# EAGLE design main (EAGLE 9.7.0)
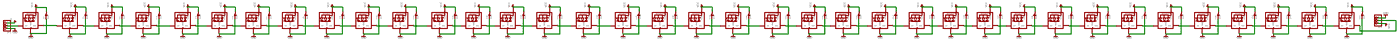
[diagram p0: schematic, sheet 1, overview]
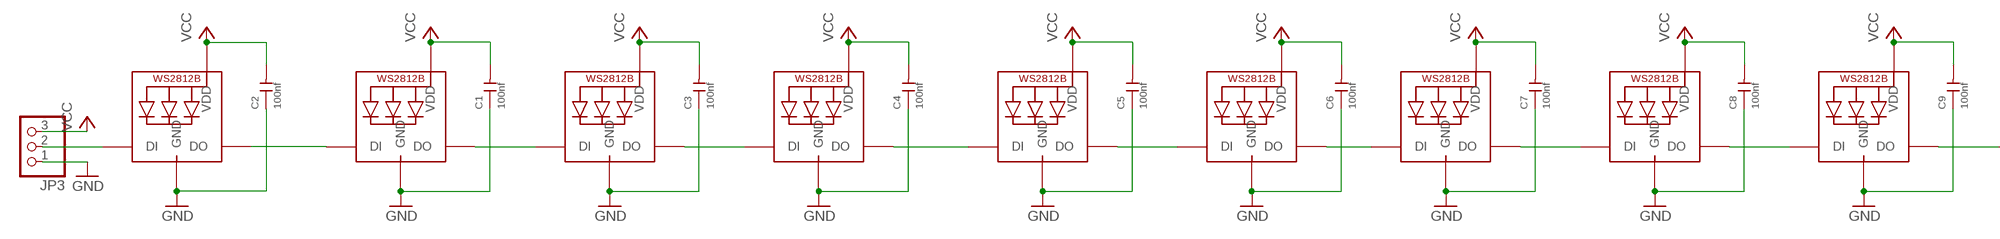
[diagram p1: schematic, sheet 1, part 1 of 4]
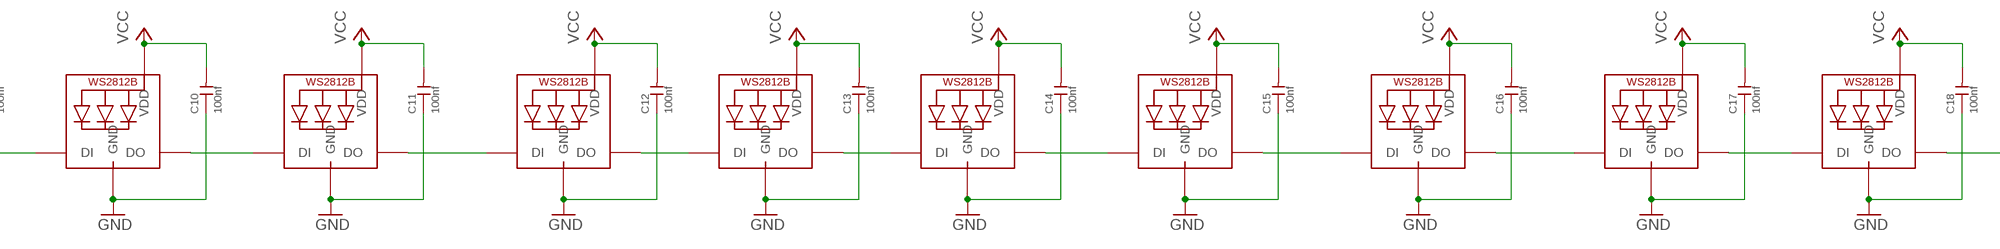
[diagram p2: schematic, sheet 1, part 2 of 4]
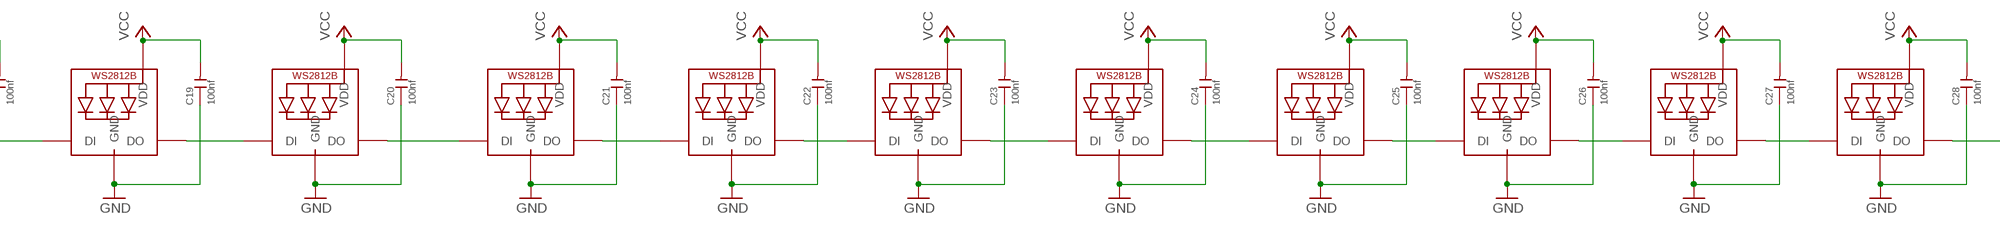
[diagram p3: schematic, sheet 1, part 3 of 4]
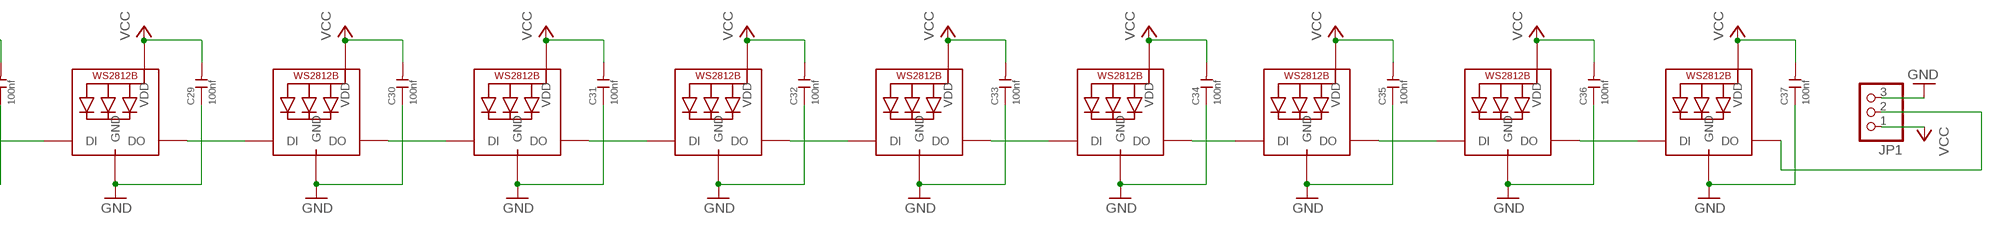
[diagram p4: schematic, sheet 1, part 4 of 4]

## Parts
C1  100nf  CERAMIC-100NF-50V-10%-X7R(0805)  [C0805]
C2  100nf  CERAMIC-100NF-50V-10%-X7R(0805)  [C0805]
C3  100nf  CERAMIC-100NF-50V-10%-X7R(0805)  [C0805]
C4  100nf  CERAMIC-100NF-50V-10%-X7R(0805)  [C0805]
C5  100nf  CERAMIC-100NF-50V-10%-X7R(0805)  [C0805]
C6  100nf  CERAMIC-100NF-50V-10%-X7R(0805)  [C0805]
C7  100nf  CERAMIC-100NF-50V-10%-X7R(0805)  [C0805]
C8  100nf  CERAMIC-100NF-50V-10%-X7R(0805)  [C0805]
C9  100nf  CERAMIC-100NF-50V-10%-X7R(0805)  [C0805]
C10  100nf  CERAMIC-100NF-50V-10%-X7R(0805)  [C0805]
C11  100nf  CERAMIC-100NF-50V-10%-X7R(0805)  [C0805]
C12  100nf  CERAMIC-100NF-50V-10%-X7R(0805)  [C0805]
C13  100nf  CERAMIC-100NF-50V-10%-X7R(0805)  [C0805]
C14  100nf  CERAMIC-100NF-50V-10%-X7R(0805)  [C0805]
C15  100nf  CERAMIC-100NF-50V-10%-X7R(0805)  [C0805]
C16  100nf  CERAMIC-100NF-50V-10%-X7R(0805)  [C0805]
C17  100nf  CERAMIC-100NF-50V-10%-X7R(0805)  [C0805]
C18  100nf  CERAMIC-100NF-50V-10%-X7R(0805)  [C0805]
C19  100nf  CERAMIC-100NF-50V-10%-X7R(0805)  [C0805]
C20  100nf  CERAMIC-100NF-50V-10%-X7R(0805)  [C0805]
C21  100nf  CERAMIC-100NF-50V-10%-X7R(0805)  [C0805]
C22  100nf  CERAMIC-100NF-50V-10%-X7R(0805)  [C0805]
C23  100nf  CERAMIC-100NF-50V-10%-X7R(0805)  [C0805]
C24  100nf  CERAMIC-100NF-50V-10%-X7R(0805)  [C0805]
C25  100nf  CERAMIC-100NF-50V-10%-X7R(0805)  [C0805]
C26  100nf  CERAMIC-100NF-50V-10%-X7R(0805)  [C0805]
C27  100nf  CERAMIC-100NF-50V-10%-X7R(0805)  [C0805]
C28  100nf  CERAMIC-100NF-50V-10%-X7R(0805)  [C0805]
C29  100nf  CERAMIC-100NF-50V-10%-X7R(0805)  [C0805]
C30  100nf  CERAMIC-100NF-50V-10%-X7R(0805)  [C0805]
C31  100nf  CERAMIC-100NF-50V-10%-X7R(0805)  [C0805]
C32  100nf  CERAMIC-100NF-50V-10%-X7R(0805)  [C0805]
C33  100nf  CERAMIC-100NF-50V-10%-X7R(0805)  [C0805]
C34  100nf  CERAMIC-100NF-50V-10%-X7R(0805)  [C0805]
C35  100nf  CERAMIC-100NF-50V-10%-X7R(0805)  [C0805]
C36  100nf  CERAMIC-100NF-50V-10%-X7R(0805)  [C0805]
C37  100nf  CERAMIC-100NF-50V-10%-X7R(0805)  [C0805]
JP1  PINHD-1X3  [1X03]
JP3  PINHD-1X3  [1X03]
L  WS2812B5050  [WS2812B]
LED1  WS2812B5050  [WS2812B]
LED3  WS2812B5050  [WS2812B]
LED4  WS2812B5050  [WS2812B]
LED5  WS2812B5050  [WS2812B]
LED6  WS2812B5050  [WS2812B]
LED7  WS2812B5050  [WS2812B]
LED8  WS2812B5050  [WS2812B]
LED9  WS2812B5050  [WS2812B]
LED10  WS2812B5050  [WS2812B]
LED11  WS2812B5050  [WS2812B]
LED12  WS2812B5050  [WS2812B]
LED13  WS2812B5050  [WS2812B]
LED14  WS2812B5050  [WS2812B]
LED15  WS2812B5050  [WS2812B]
LED16  WS2812B5050  [WS2812B]
LED17  WS2812B5050  [WS2812B]
LED18  WS2812B5050  [WS2812B]
LED19  WS2812B5050  [WS2812B]
LED20  WS2812B5050  [WS2812B]
LED21  WS2812B5050  [WS2812B]
LED22  WS2812B5050  [WS2812B]
LED23  WS2812B5050  [WS2812B]
LED24  WS2812B5050  [WS2812B]
LED25  WS2812B5050  [WS2812B]
LED26  WS2812B5050  [WS2812B]
LED27  WS2812B5050  [WS2812B]
LED28  WS2812B5050  [WS2812B]
LED29  WS2812B5050  [WS2812B]
LED30  WS2812B5050  [WS2812B]
LED31  WS2812B5050  [WS2812B]
LED32  WS2812B5050  [WS2812B]
LED33  WS2812B5050  [WS2812B]
LED34  WS2812B5050  [WS2812B]
LED35  WS2812B5050  [WS2812B]
LED36  WS2812B5050  [WS2812B]
LED37  WS2812B5050  [WS2812B]

## Nets
GND: C1.1 C2.1 C3.1 C4.1 C5.1 C6.1 C7.1 C8.1 C9.1 C10.1 C11.1 C12.1 C13.1 C14.1 C15.1 C16.1 C17.1 C18.1 C19.1 C20.1 C21.1 C22.1 C23.1 C24.1 C25.1 C26.1 C27.1 C28.1 C29.1 C30.1 C31.1 C32.1 C33.1 C34.1 C35.1 C36.1 C37.1 JP1.3 JP3.1 L.3-GND(GND) LED1.3-GND(GND) LED3.3-GND(GND) LED4.3-GND(GND) LED5.3-GND(GND) LED6.3-GND(GND) LED7.3-GND(GND) LED8.3-GND(GND) LED9.3-GND(GND) LED10.3-GND(GND) LED11.3-GND(GND) LED12.3-GND(GND) LED13.3-GND(GND) LED14.3-GND(GND) LED15.3-GND(GND) LED16.3-GND(GND) LED17.3-GND(GND) LED18.3-GND(GND) LED19.3-GND(GND) LED20.3-GND(GND) LED21.3-GND(GND) LED22.3-GND(GND) LED23.3-GND(GND) LED24.3-GND(GND) LED25.3-GND(GND) LED26.3-GND(GND) LED27.3-GND(GND) LED28.3-GND(GND) LED29.3-GND(GND) LED30.3-GND(GND) LED31.3-GND(GND) LED32.3-GND(GND) LED33.3-GND(GND) LED34.3-GND(GND) LED35.3-GND(GND) LED36.3-GND(GND) LED37.3-GND(GND)
N$1: L.2-DOUT(DO) LED1.4-DIN(DI)
N$2: LED1.2-DOUT(DO) LED3.4-DIN(DI)
N$3: LED3.2-DOUT(DO) LED4.4-DIN(DI)
N$4: LED4.2-DOUT(DO) LED5.4-DIN(DI)
N$5: LED5.2-DOUT(DO) LED6.4-DIN(DI)
N$6: LED6.2-DOUT(DO) LED7.4-DIN(DI)
N$7: LED7.2-DOUT(DO) LED8.4-DIN(DI)
N$8: LED8.2-DOUT(DO) LED9.4-DIN(DI)
N$9: LED9.2-DOUT(DO) LED10.4-DIN(DI)
N$10: LED10.2-DOUT(DO) LED11.4-DIN(DI)
N$11: LED11.2-DOUT(DO) LED12.4-DIN(DI)
N$12: LED12.2-DOUT(DO) LED13.4-DIN(DI)
N$13: LED13.2-DOUT(DO) LED14.4-DIN(DI)
N$14: LED14.2-DOUT(DO) LED15.4-DIN(DI)
N$15: LED15.2-DOUT(DO) LED16.4-DIN(DI)
N$16: LED16.2-DOUT(DO) LED17.4-DIN(DI)
N$17: LED17.2-DOUT(DO) LED18.4-DIN(DI)
N$18: LED18.2-DOUT(DO) LED19.4-DIN(DI)
N$19: LED19.2-DOUT(DO) LED20.4-DIN(DI)
N$20: LED20.2-DOUT(DO) LED21.4-DIN(DI)
N$21: LED21.2-DOUT(DO) LED22.4-DIN(DI)
N$22: LED22.2-DOUT(DO) LED23.4-DIN(DI)
N$23: LED23.2-DOUT(DO) LED24.4-DIN(DI)
N$24: LED24.2-DOUT(DO) LED25.4-DIN(DI)
N$25: LED25.2-DOUT(DO) LED26.4-DIN(DI)
N$26: LED26.2-DOUT(DO) LED27.4-DIN(DI)
N$27: LED27.2-DOUT(DO) LED28.4-DIN(DI)
N$28: LED28.2-DOUT(DO) LED29.4-DIN(DI)
N$29: LED29.2-DOUT(DO) LED30.4-DIN(DI)
N$30: LED30.2-DOUT(DO) LED31.4-DIN(DI)
N$31: LED31.2-DOUT(DO) LED32.4-DIN(DI)
N$32: LED32.2-DOUT(DO) LED33.4-DIN(DI)
N$33: LED33.2-DOUT(DO) LED34.4-DIN(DI)
N$34: LED34.2-DOUT(DO) LED35.4-DIN(DI)
N$35: LED35.2-DOUT(DO) LED36.4-DIN(DI)
N$36: LED36.2-DOUT(DO) LED37.4-DIN(DI)
N$37: JP3.2 L.4-DIN(DI)
N$38: JP1.2 LED37.2-DOUT(DO)
VCC: C1.2 C2.2 C3.2 C4.2 C5.2 C6.2 C7.2 C8.2 C9.2 C10.2 C11.2 C12.2 C13.2 C14.2 C15.2 C16.2 C17.2 C18.2 C19.2 C20.2 C21.2 C22.2 C23.2 C24.2 C25.2 C26.2 C27.2 C28.2 C29.2 C30.2 C31.2 C32.2 C33.2 C34.2 C35.2 C36.2 C37.2 JP1.1 JP3.3 L.1-VDD(VDD) LED1.1-VDD(VDD) LED3.1-VDD(VDD) LED4.1-VDD(VDD) LED5.1-VDD(VDD) LED6.1-VDD(VDD) LED7.1-VDD(VDD) LED8.1-VDD(VDD) LED9.1-VDD(VDD) LED10.1-VDD(VDD) LED11.1-VDD(VDD) LED12.1-VDD(VDD) LED13.1-VDD(VDD) LED14.1-VDD(VDD) LED15.1-VDD(VDD) LED16.1-VDD(VDD) LED17.1-VDD(VDD) LED18.1-VDD(VDD) LED19.1-VDD(VDD) LED20.1-VDD(VDD) LED21.1-VDD(VDD) LED22.1-VDD(VDD) LED23.1-VDD(VDD) LED24.1-VDD(VDD) LED25.1-VDD(VDD) LED26.1-VDD(VDD) LED27.1-VDD(VDD) LED28.1-VDD(VDD) LED29.1-VDD(VDD) LED30.1-VDD(VDD) LED31.1-VDD(VDD) LED32.1-VDD(VDD) LED33.1-VDD(VDD) LED34.1-VDD(VDD) LED35.1-VDD(VDD) LED36.1-VDD(VDD) LED37.1-VDD(VDD)

## Library data of the parts
C1-C37 = OPL_Capacitor:CERAMIC-100NF-50V-10%-X7R(0805): 302010165; MPN: CC0805KRX7R9BB104
JP1 JP3 = adafruit:PINHD-1X3: PIN HEADER
L LED1 LED3-LED37 = adafruit:WS2812B

## Board
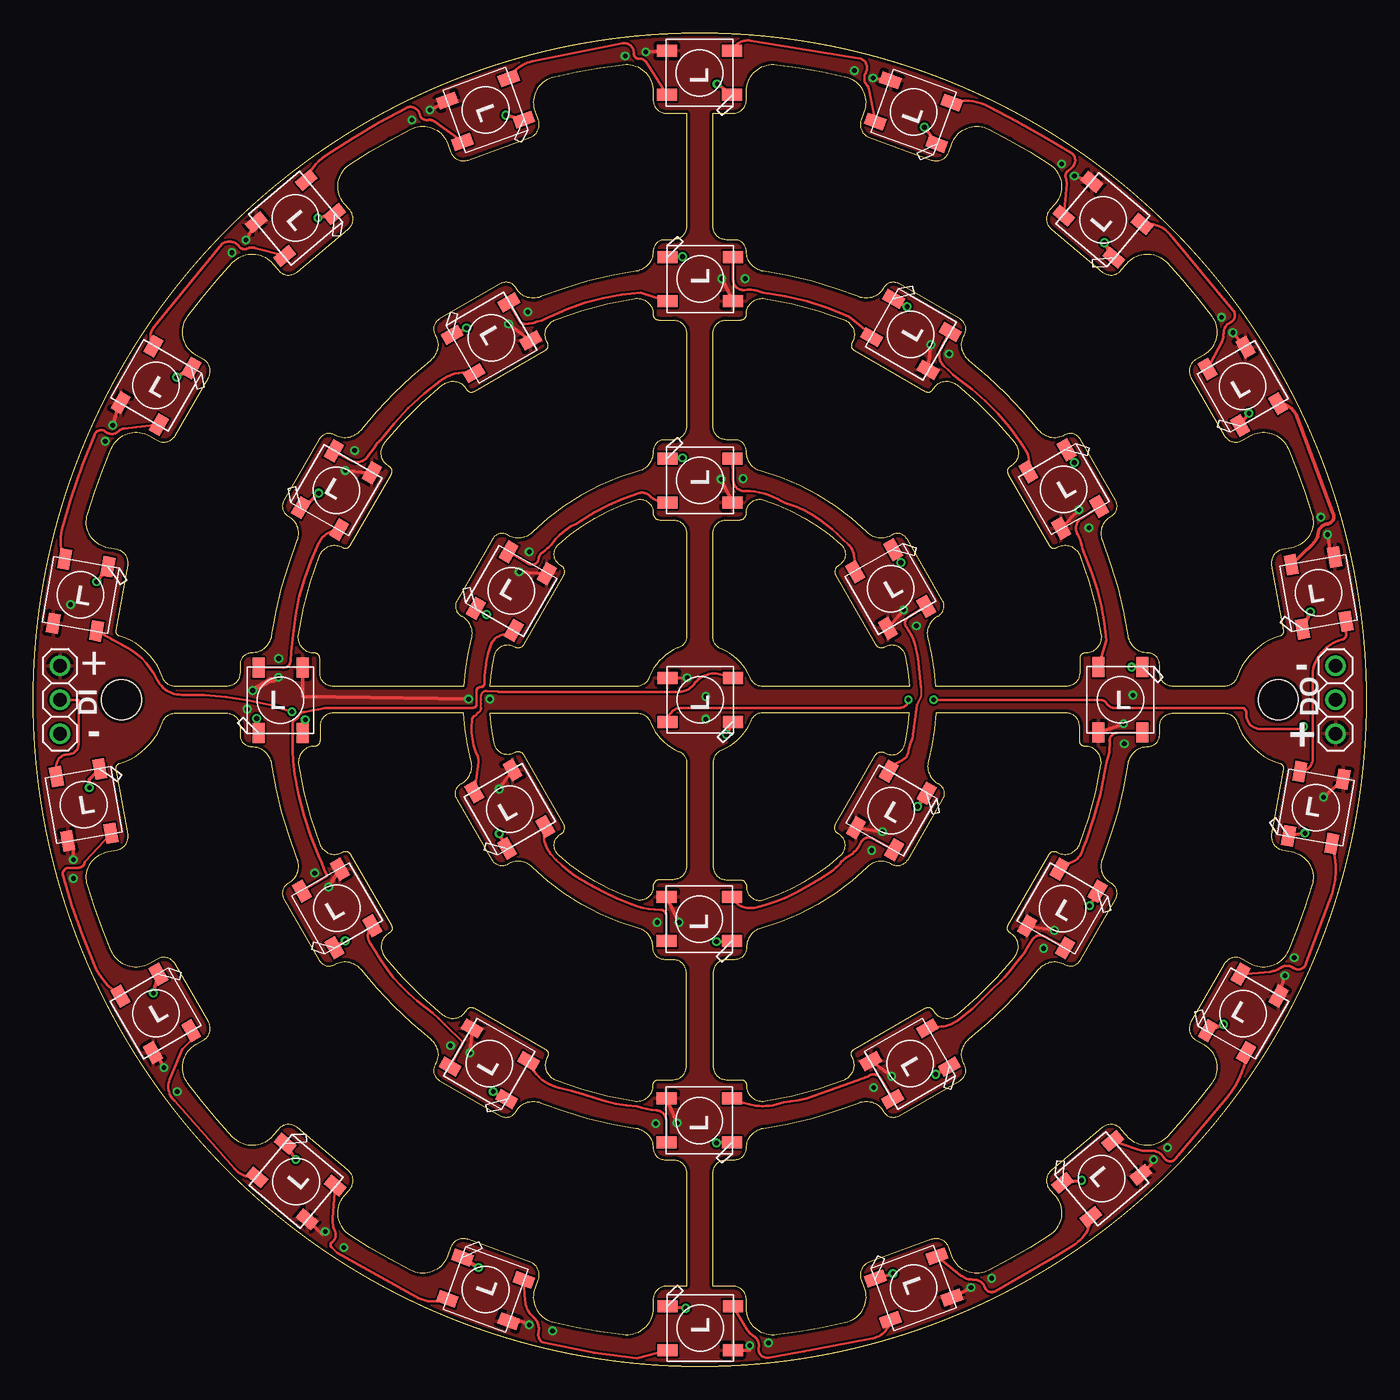
[diagram p5: board, top side]
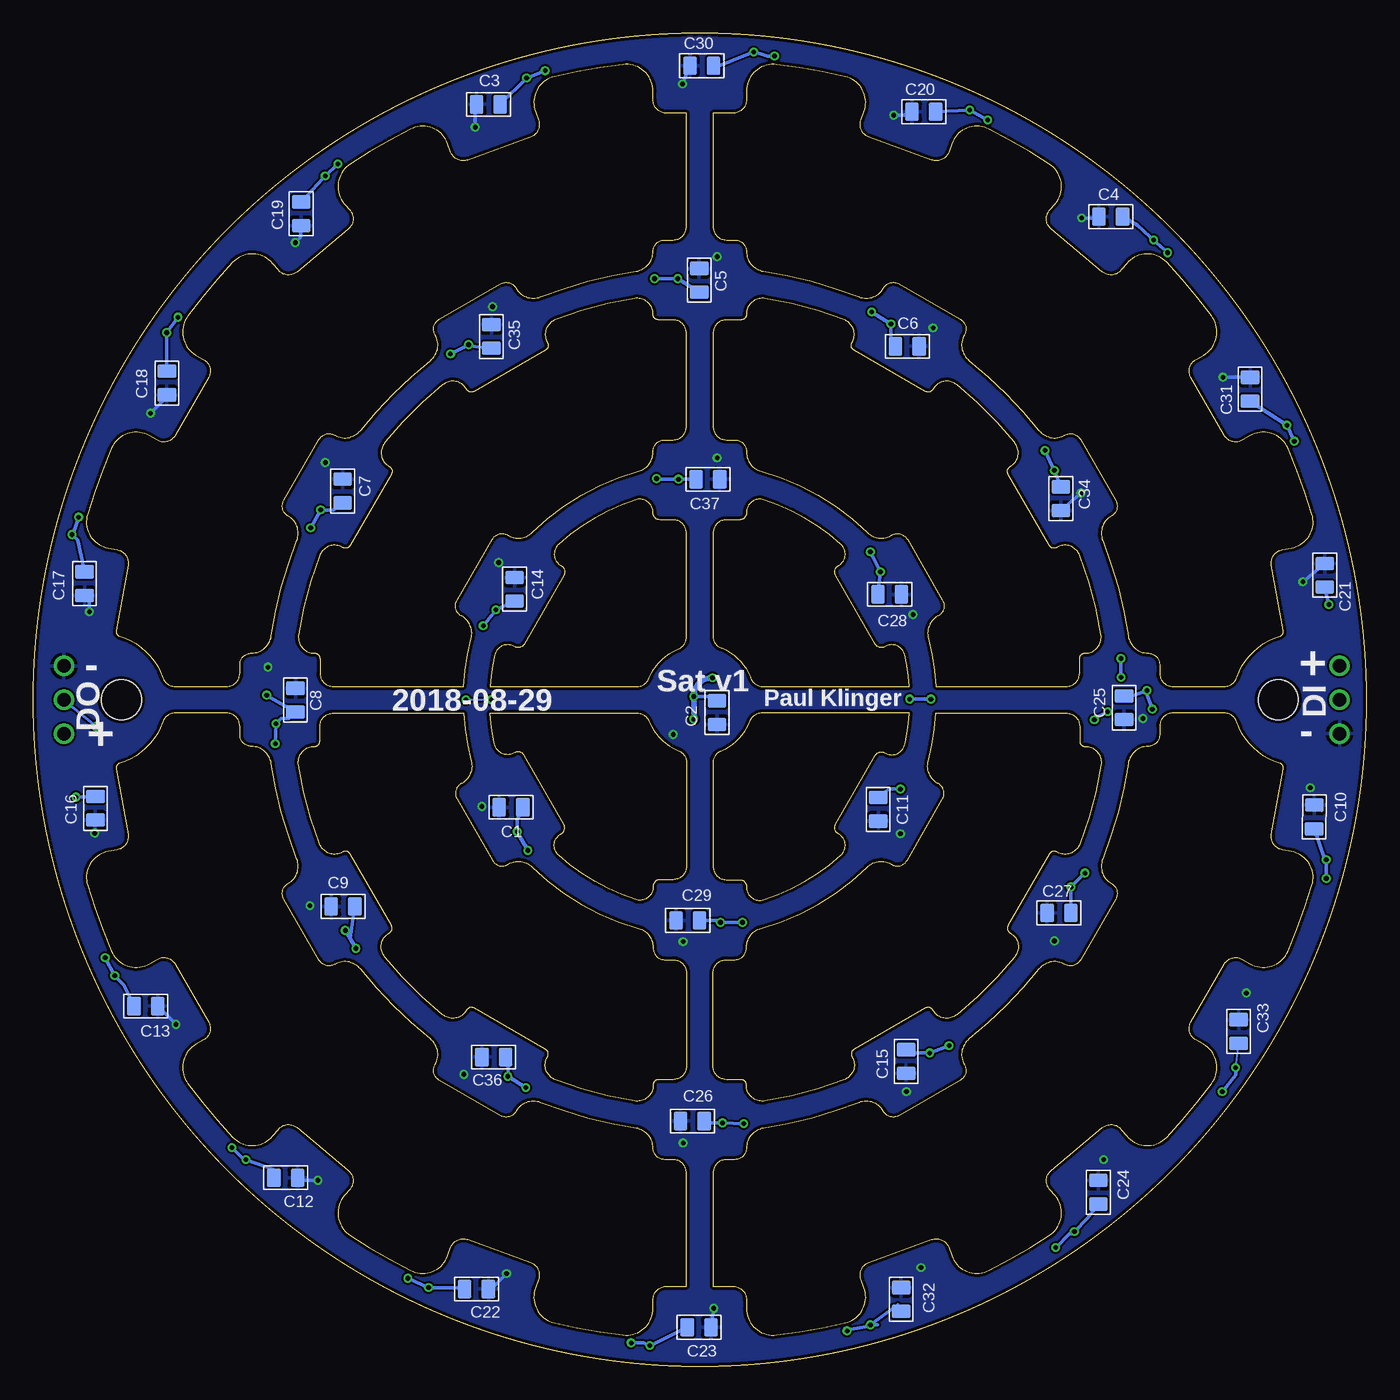
[diagram p6: board, bottom side, seen from below]

Size 100 x 100 mm. Coordinates in mm from the lower left corner, seen from the top.
Outline: 53.5,95 53.5,95.67 arc-97 55.74,97.66 arc-6 60.91,96.75 arc-97 62.33,94.11 62.1,93.48 arc90 62.7,92.2 67.4,90.49 arc90 68.68,91.09 68.91,91.72 arc-97 71.69,92.82 arc-6 76.24,90.19 arc-97 76.67,87.23 76.24,86.72 arc90 76.37,85.31 80.2,82.1 arc90 81.61,82.22 82.04,82.74 arc-97 85.03,82.82 arc-6 88.4,78.8 arc-97 87.8,75.87 87.22,75.53 arc90 86.85,74.16 89.35,69.84 arc90 90.72,69.47 91.3,69.8 arc-97 94.14,68.86 arc-6 95.94,63.93 arc-97 94.37,61.38 93.71,61.26 arc90 92.9,60.1 93.77,55.18 arc2 93.77,55.14 arc-86 93.57,54.79 arc54 90.29,51.67 arc-71 89.34,51 85.5,51 arc-90 84.5,52 84.5,52.65 arc90 83.65,53.5 83.63,53.5 arc-82 82.15,54.78 arc13 80.23,61.93 arc-82 80.88,63.78 80.89,63.79 arc90 81.2,64.95 78.55,69.55 arc90 77.39,69.86 77.38,69.85 arc-82 75.45,70.21 arc13 70.21,75.45 arc-82 69.85,77.38 69.86,77.39 arc90 69.55,78.55 64.95,81.2 arc90 63.79,80.89 63.78,80.88 arc-82 61.93,80.23 arc13 54.78,82.15 arc-82 53.5,83.63 53.5,83.65 arc90 52.65,84.5 52,84.5 arc-90 51,85.5 51,94 52.5,94 arc90 53.5,95
Outline: 46.5,95.67 46.5,95 arc90 47.5,94 49,94 49,85.5 arc-90 48,84.5 47.35,84.5 arc90 46.5,83.65 46.5,83.63 arc-82 45.22,82.15 arc13 38.07,80.23 arc-82 36.22,80.88 36.21,80.89 arc90 35.05,81.2 30.45,78.55 arc90 30.14,77.39 30.15,77.38 arc-82 29.79,75.45 arc13 24.55,70.21 arc-82 22.62,69.85 22.61,69.86 arc90 21.45,69.55 18.8,64.95 arc90 19.11,63.79 19.12,63.78 arc-82 19.77,61.93 arc13 17.85,54.78 arc-82 16.37,53.5 16.35,53.5 arc90 15.5,52.65 15.5,52 arc-90 14.5,51 10.66,51 arc-71 9.71,51.67 arc54 6.43,54.79 arc-86 6.23,55.14 arc2 6.23,55.18 7.1,60.1 arc90 6.29,61.26 5.63,61.38 arc-97 4.06,63.93 arc-6 5.86,68.86 arc-97 8.7,69.8 9.28,69.47 arc90 10.65,69.84 13.15,74.16 arc90 12.78,75.53 12.2,75.87 arc-97 11.6,78.8 arc-6 14.97,82.82 arc-97 17.96,82.74 18.39,82.22 arc90 19.8,82.1 23.63,85.31 arc90 23.76,86.72 23.32,87.23 arc-97 23.76,90.19 arc-6 28.31,92.82 arc-97 31.09,91.72 31.32,91.09 arc90 32.6,90.49 37.3,92.2 arc90 37.9,93.48 37.67,94.11 arc-97 39.09,96.75 arc-6 44.26,97.66 arc-97 46.5,95.67
Outline: 4.06,36.07 arc-97 5.63,38.62 6.29,38.74 arc90 7.1,39.9 6.23,44.82 arc2 6.23,44.86 arc-86 6.43,45.21 arc54 9.71,48.33 arc-71 10.66,49 14.5,49 arc-90 15.5,48 15.5,47.35 arc90 16.35,46.5 16.37,46.5 arc-82 17.85,45.22 arc13 19.77,38.07 arc-82 19.12,36.22 19.11,36.21 arc90 18.8,35.05 21.45,30.45 arc90 22.61,30.14 22.62,30.15 arc-82 24.55,29.79 arc13 29.79,24.55 arc-82 30.15,22.62 30.14,22.61 arc90 30.45,21.45 35.05,18.8 arc90 36.21,19.11 36.22,19.12 arc-82 38.07,19.77 arc13 45.22,17.85 arc-82 46.5,16.37 46.5,16.35 arc90 47.35,15.5 48,15.5 arc-90 49,14.5 49,6 47.5,6 arc90 46.5,5 46.5,4.33 arc-97 44.26,2.34 arc-6 39.09,3.26 arc-97 37.67,5.89 37.9,6.52 arc90 37.3,7.8 32.6,9.51 arc90 31.32,8.91 31.09,8.28 arc-97 28.31,7.18 arc-6 23.76,9.8 arc-97 23.32,12.77 23.76,13.28 arc90 23.63,14.69 19.8,17.9 arc90 18.39,17.78 17.96,17.26 arc-97 14.97,17.18 arc-6 11.6,21.2 arc-97 12.2,24.13 12.78,24.47 arc90 13.15,25.84 10.65,30.16 arc90 9.28,30.53 8.7,30.2 arc-97 5.86,31.14 arc-6 4.06,36.07
Outline: 55.74,2.34 arc-97 53.5,4.33 53.5,5 arc90 52.5,6 51,6 51,14.5 arc-90 52,15.5 52.65,15.5 arc90 53.5,16.35 53.5,16.37 arc-82 54.78,17.85 arc13 61.93,19.77 arc-82 63.78,19.12 63.79,19.11 arc90 64.95,18.8 69.55,21.45 arc90 69.86,22.61 69.85,22.62 arc-82 70.21,24.55 arc13 75.45,29.79 arc-82 77.38,30.15 77.39,30.14 arc90 78.55,30.45 81.2,35.05 arc90 80.89,36.21 80.88,36.22 arc-82 80.23,38.07 arc13 82.15,45.22 arc-82 83.63,46.5 83.65,46.5 arc90 84.5,47.35 84.5,48 arc-90 85.5,49 89.34,49 arc-71 90.29,48.33 arc54 93.57,45.21 arc-86 93.77,44.86 arc2 93.77,44.82 92.9,39.9 arc90 93.71,38.74 94.37,38.62 arc-97 95.94,36.07 arc-6 94.14,31.14 arc-97 91.3,30.2 90.72,30.53 arc90 89.35,30.16 86.85,25.84 arc90 87.22,24.47 87.8,24.13 arc-97 88.4,21.2 arc-6 85.03,17.18 arc-97 82.04,17.26 81.61,17.78 arc90 80.2,17.9 76.37,14.69 arc90 76.24,13.28 76.67,12.77 arc-97 76.24,9.8 arc-6 71.69,7.18 arc-97 68.91,8.28 68.68,8.91 arc90 67.4,9.51 62.7,7.8 arc90 62.1,6.52 62.33,5.89 arc-97 60.91,3.26 arc-6 55.74,2.34
Outline: 46.5,78.92 46.5,78.9 arc90 46.9,78.5 48,78.5 arc-90 49,77.5 49,70.5 arc-90 48,69.5 47.35,69.5 arc90 46.5,68.65 46.5,68.59 arc-75 45.39,67.14 arc30 37.46,62.56 arc-75 35.65,62.33 35.6,62.36 arc90 34.44,62.05 31.79,57.45 arc90 32.1,56.29 32.15,56.26 arc-75 32.85,54.58 arc12 32.28,51 22.5,51 arc-90 21.5,52 21.5,53.1 arc90 21.1,53.5 21.08,53.5 arc-99 19.89,54.89 arc-12 21.48,60.82 arc-99 23.2,61.43 23.22,61.42 arc90 23.77,61.56 26.87,66.94 arc90 26.72,67.48 26.7,67.49 arc-99 26.38,69.29 arc-12 30.71,73.62 arc-99 32.51,73.3 32.52,73.28 arc90 33.06,73.13 38.44,76.23 arc90 38.58,76.78 38.57,76.8 arc-99 39.18,78.52 arc-12 45.11,80.11 arc-99 46.5,78.92
Outline: 53.5,78.9 53.5,78.92 arc-99 54.89,80.11 arc-12 60.82,78.52 arc-99 61.43,76.8 61.42,76.78 arc90 61.56,76.23 66.94,73.13 arc90 67.48,73.28 67.49,73.3 arc-99 69.29,73.62 arc-12 73.62,69.29 arc-99 73.3,67.49 73.28,67.48 arc90 73.13,66.94 76.23,61.56 arc90 76.78,61.42 76.8,61.43 arc-99 78.52,60.82 arc-12 80.11,54.89 arc-99 78.92,53.5 78.9,53.5 arc90 78.5,53.1 78.5,52 arc-90 77.5,51 67.72,51 arc12 67.15,54.58 arc-75 67.85,56.26 67.9,56.29 arc90 68.21,57.45 65.56,62.05 arc90 64.4,62.36 64.35,62.33 arc-75 62.54,62.56 arc30 54.61,67.14 arc-75 53.5,68.59 53.5,68.65 arc90 52.65,69.5 52,69.5 arc-90 51,70.5 51,77.5 arc-90 52,78.5 53.1,78.5 arc90 53.5,78.9
Outline: 21.5,46.9 arc-90 21.1,46.5 21.08,46.5 arc99 19.89,45.11 arc12 21.48,39.18 arc99 23.2,38.57 23.22,38.58 arc-90 23.77,38.44 26.87,33.06 arc-90 26.72,32.52 26.7,32.51 arc99 26.38,30.71 arc12 30.71,26.38 arc99 32.51,26.7 32.52,26.72 arc-90 33.06,26.87 38.44,23.77 arc-90 38.58,23.22 38.57,23.2 arc99 39.18,21.48 arc12 45.11,19.89 arc99 46.5,21.08 46.5,21.1 arc-90 46.9,21.5 48,21.5 arc90 49,22.5 49,29.5 arc90 48,30.5 47.35,30.5 arc-90 46.5,31.35 46.5,31.41 arc75 45.39,32.86 arc-30 37.46,37.44 arc75 35.65,37.67 35.6,37.64 arc-90 34.44,37.95 31.79,42.55 arc-90 32.1,43.71 32.15,43.74 arc75 32.85,45.42 arc-12 32.28,49 22.5,49 arc90 21.5,48 21.5,46.9
Outline: 53.1,21.5 arc-90 53.5,21.1 53.5,21.08 arc99 54.89,19.89 arc12 60.82,21.48 arc99 61.43,23.2 61.42,23.22 arc-90 61.56,23.77 66.94,26.87 arc-90 67.48,26.72 67.49,26.7 arc99 69.29,26.38 arc12 73.62,30.71 arc99 73.3,32.51 73.28,32.52 arc-90 73.13,33.06 76.23,38.44 arc-90 76.78,38.58 76.8,38.57 arc99 78.52,39.18 arc12 80.11,45.11 arc99 78.92,46.5 78.9,46.5 arc-90 78.5,46.9 78.5,48 arc90 77.5,49 67.72,49 arc-12 67.15,45.42 arc75 67.85,43.74 67.9,43.71 arc-90 68.21,42.55 65.56,37.95 arc-90 64.4,37.64 64.35,37.67 arc75 62.54,37.44 arc-30 54.61,32.86 arc75 53.5,31.41 53.5,31.35 arc-90 52.65,30.5 52,30.5 arc90 51,29.5 51,22.5 arc90 52,21.5 53.1,21.5
Outline: 46.5,64.05 46.5,64 arc90 47,63.5 48,63.5 arc-90 49,62.5 49,54.58 arc-66 48.3,53.87 arc43 46.23,51.8 arc-66 45.42,51 34.28,51 arc-9 34.61,53.34 arc-108 36.09,53.99 36.13,53.97 arc90 36.81,54.15 39.81,59.35 arc90 39.63,60.03 39.59,60.05 arc-108 39.41,61.66 arc-24 45.2,65 arc-108 46.5,64.05
Outline: 53.5,64 53.5,64.05 arc-108 54.8,65 arc-24 60.59,61.66 arc-108 60.41,60.05 60.37,60.03 arc90 60.19,59.35 63.19,54.15 arc90 63.87,53.97 63.91,53.99 arc-108 65.39,53.34 arc-9 65.72,51 54.58,51 arc-66 53.77,51.7 arc43 51.7,53.77 arc-66 51,54.58 51,62.5 arc-90 52,63.5 53,63.5 arc90 53.5,64
Outline: 39.81,40.65 36.81,45.85 arc90 36.13,46.03 36.09,46.01 arc-108 34.61,46.66 arc-9 34.28,49 45.42,49 arc-66 46.33,48.2 arc43 48.4,46.13 arc-66 49,45.42 49,37.5 arc-90 48,36.5 47,36.5 arc90 46.5,36 46.5,35.95 arc-108 45.2,35 arc-24 39.41,38.34 arc-108 39.59,39.95 39.63,39.97 arc90 39.81,40.65
Outline: 53,36.5 arc-90 53.5,36 53.5,35.95 arc108 54.8,35 arc24 60.59,38.34 arc108 60.41,39.95 60.37,39.97 arc-90 60.19,40.65 63.19,45.85 arc-90 63.87,46.03 63.91,46.01 arc108 65.39,46.66 arc9 65.72,49 54.58,49 arc66 53.77,48.3 arc-43 51.7,46.23 arc66 51,45.42 51,37.5 arc90 52,36.5 53,36.5
Outline: circle at 50,50 radius 50
Copper layers (1*16): Top 0.035mm / dielectric 1.5mm / Bottom 0.035mm
Design rules "dirt_cheap_dirty_boards.v1.1": minimum track width 6mil, minimum drill 12mil, track to track 6mil, track to pad 6mil, pad to pad 6mil, via to via 6mil, smd to smd 0mil, copper to edge 10mil, drill to drill 10mil, minimum pad ring 10mil, minimum via ring 6mil, stop-mask expansion 2mil, vias tented up to drill 25mil, thermal gap 10mil
Holes 3 mm at 6.6,50 93.4,50

### Footprints (pad centres in the part's own frame; a part is rotated, then mirrored left to right if it is on the bottom)
C0805 = smd 1.397 x 1.016: 1 0,0.889; 2 0,-0.889
1X03 = drill 1.016: 1 -2.54,0; 2 0,0; 3 2.54,0
WS2812B = smd 1.5 x 0.9: 1-VDD 2.45,-1.65; 2-DOUT 2.45,1.65; 3-GND -2.45,1.65; 4-DIN -2.45,-1.65

### Placement (x,y rotation side)
C1  64.16,41.93 90 bottom
C2  48.7,49.04 180 bottom
C3  65.86,94.67 90 bottom
C4  19.16,86.24 90 bottom
C5  50.04,81.47 0 bottom
C6  34.43,76.52 270 bottom
C7  76.8,65.67 0 bottom
C8  80.33,49.97 0 bottom
C9  76.77,34.49 90 bottom
C10  3.9,41.2 359.5 bottom
C11  36.61,41.78 180 bottom
C12  81.06,14.14 270 bottom
C13  91.56,27.02 270 bottom
C14  63.9,58.29 0 bottom
C15  34.52,22.86 180 bottom
C16  95.34,41.86 180 bottom
C17  96.16,58.71 180 bottom
C18  89.98,73.76 180 bottom
C19  79.9,86.46 180 bottom
C20  33.19,94.12 90 bottom
C21  3.11,59.34 0 bottom
C22  66.75,5.79 270 bottom
C23  50.05,2.92 270 bottom
C24  20.1,13.05 0 bottom
C25  18.17,49.4 180 bottom
C26  50.55,18.39 90 bottom
C27  23.05,34.01 90 bottom
C28  35.75,57.91 270 bottom
C29  50.9,33.45 90 bottom
C30  49.85,97.57 90 bottom
C31  8.71,73.3 0 bottom
C32  34.89,5.01 0 bottom
C33  9.57,25.11 0 bottom
C34  22.9,65.09 180 bottom
C35  65.63,77.26 0 bottom
C36  65.46,23.19 90 bottom
C37  49.39,66.54 270 bottom
JP1  97.7,50 90 top
JP3  2,50 90 top
L  3.78,42.11 280 top
LED1  9.19,26.47 300 top
LED3  19.72,13.86 320 top
LED4  33.93,5.76 340 top
LED5  50.04,2.86 0 top
LED6  66.05,5.86 20 top
LED7  80.16,14.06 40 top
LED8  90.77,26.46 60 top
LED9  96.22,41.91 80 top
LED10  96.43,58.01 100 top
LED11  90.74,73.51 120 top
LED12  80.25,86.01 140 top
LED13  66.04,94.09 160 top
LED14  49.98,97.04 180 top
LED15  33.93,94.24 200 top
LED16  19.67,86.14 220 top
LED17  9.21,73.59 240 top
LED18  3.55,57.86 260 top
LED19  18.54,49.96 90 top
LED20  22.74,65.72 60 top
LED21  34.37,77.16 30 top
LED22  50.03,81.56 0 top
LED23  65.84,77.41 330 top
LED24  77.31,65.8 300 top
LED25  81.56,49.99 270 top
LED26  77.21,34.33 240 top
LED27  65.78,22.69 210 top
LED28  49.97,18.44 180 top
LED29  34.21,22.69 150 top
LED30  22.79,34.35 120 top
LED31  35.86,58.16 60 top
LED32  50.02,66.46 0 top
LED33  64.32,58.31 300 top
LED34  64.37,41.69 240 top
LED35  49.96,33.54 180 top
LED36  35.75,41.79 120 top
LED37  50.04,49.99 180 top

### Tracks (layer width: path | path; a pad name or v marks a point on that pad's centre or on a via)
GND  (via drill 0.35)
  Top 0.152: L.3-GND arc90 5.3,45.13
  Top 0.2: LED31.3-GND v34,56.4
  Top 0.254: 5.3,45.13 arc-90 L.3-GND 4.2,44.03 v4.2,43.4 | LED1.3-GND v9,28 | LED3.3-GND v19.7,15.5 | LED4.3-GND v33.4,7.4 | LED9.3-GND v95.4,40 | LED5.3-GND v48.95,4.35 | LED6.3-GND v64.5,6.95 | LED7.3-GND v78.65,13.95 | LED8.3-GND v89.3,25.65 | LED10.3-GND v95.8,56.6 | LED11.3-GND v91.2,71.5 | LED12.3-GND v80.35,84.3 | LED13.3-GND v66.85,92.95 | LED14.3-GND v51.3,96.2 | LED15.3-GND v35.45,93.85 | LED16.3-GND v21.35,86.15 | LED17.3-GND v10.75,74.2 | LED18.3-GND v4.75,58.85 | LED20.3-GND 20.21,64.31 v21.4,65.5 | v16.75,48.6 LED19.3-GND | LED21.3-GND v32.5,77.9 | LED22.3-GND v48.7,83.25 | LED23.3-GND v65.55,79.5 | LED24.3-GND v78.1,67.8 | LED25.3-GND v82.4,52.45 | LED26.3-GND v79.25,34.55 | LED27.3-GND v67.7,21.9 | LED28.3-GND v51.25,16.75 | LED29.3-GND v34.5,20.6 | LED32.3-GND v48.7,68.15 | LED34.3-GND v66.35,42 | LED35.3-GND v51.25,31.85 | LED36.3-GND v34.95,39.95 | LED37.3-GND v52,47.4 | LED33.3-GND v65.1,60.3 | LED30.3-GND v23.4,31.9
  Bottom 0.254: v48.95,4.35 C23.1 | C22.1 65.41,6.04 v64.5,6.95 | C12.1 80.17,13.95 v78.65,13.95 | C13.1 v89.3,25.65 | C17.1 95.8,57.42 v95.8,56.6 | C18.1 89.81,72.89 v91.2,71.5 | C19.1 79.96,84.69 v80.35,84.3 | v66.85,92.95 66.85,94.66 C3.1 | v51.3,96.2 51.3,96.22 C30.1 | v35.45,93.85 34.65,93.85 C20.1 | v21.35,86.15 20.06,86.15 C4.1 | v10.75,74.2 v10.74,74.21 C31.1 | v4.75,58.85 C21.1 | v21.4,65.5 C34.1
  pour Bottom: -11,114 -7,-11 121,-19 109,104
N$1
  Top 0.152: LED1.4-DIN 5.9,28.3
  Top 0.2: 5.9,28.3 arc-26 4.62,30.01 arc-9 2.2,36.9 arc-90 2.7,37.4 3.4,37.4 arc90 3.85,37.85 L.2-DOUT
N$2
  Top 0.152: LED1.2-DOUT 11.84,24.44
  Top 0.2: 11.84,24.44 11.18,23.78 10.23,21.51 arc72 10.62,19.9 15.1,14.8 arc56 LED3.4-DIN
N$3
  Top 0.2: LED4.4-DIN arc-51 28.7,5.2 22.8,8.5 22.4,8.9 arc-111 22.4,9.3 arc81 22.63,10.13 arc-29 22.45,11.1 22.64,13.53 LED3.2-DOUT
N$4
  Top 0.2: LED4.2-DOUT 36.9,4.9 arc46 37.5,3.7 arc-62 37.9,2.5 arc71 38.2,1.8 42.1,1 45.3,0.6 LED5.4-DIN
N$5
  Top 0.2: LED5.2-DOUT 53.5,2.8 arc29 54,2.3 arc-70 54.42,1.38 arc111 55.15,0.65 57.81,1.1 63,2.1 arc71 LED6.4-DIN
N$6
  Top 0.2: LED6.2-DOUT 69.6,6.8 arc40 70.5,6.5 arc-71 71.4,5.9 arc92 72.1,5.6 76.83,8.3 78.2,9.2 arc55 LED7.4-DIN
N$7
  Top 0.2: LED7.2-DOUT 82.73,16.32 83.2,16.17 83.97,16.16 arc-61 84.82,15.65 arc108 85.69,15.54 89.56,20.14 arc29 90.97,23.12 LED8.4-DIN
N$8
  Top 0.2: LED8.2-DOUT 92.8,29.6 arc31 93.6,29.9 arc-72 94.5,29.9 arc85 95.4,30 97.29,34.96 arc38 LED9.4-DIN
N$9
  Top 0.2: LED9.2-DOUT arc90 96,45.59 96,52.1 arc-70 98.19,54.51 arc96 98.48,55.03 LED10.4-DIN
N$10
  Top 0.254: LED10.2-DOUT 96,61.7 arc39 96.4,62.5 arc-76 97.1,63.2 arc113 97.5,64 94.8,71.27 arc71 LED11.4-DIN
N$11
  Top 0.2: LED11.2-DOUT 89.15,76.85 arc29 89.3,77.5 arc-67 89.8,78.3 arc107 90,79.25 85.28,84.91 arc59 LED12.4-DIN
N$12
  Top 0.2: LED12.2-DOUT 77.55,88.7 77.45,89.2 arc-66 77.65,89.7 arc20 78.05,90.1 arc94 77.85,91.05 arc4 71.7,94.5 arc43 LED13.4-DIN
N$13
  Top 0.2: LED13.2-DOUT 62.7,95.8 arc31 62.55,96.1 arc-72 62.45,97.05 arc97 62.1,98.1 53.8,99.46 arc77 LED14.4-DIN
N$14
  Top 0.2: LED14.2-DOUT 45.95,97.85 arc61 45.45,98.1 arc-98 45.05,98.5 arc105 44.2,99.25 37.46,97.9 arc48 LED15.4-DIN
N$15
  Top 0.2: LED15.2-DOUT 30.05,93.4 arc47 29.6,93.5 arc-89 29,93.9 arc105 27.95,94.4 arc7 21.95,90.85 arc36 LED16.4-DIN
N$16
  Top 0.2: LED16.2-DOUT 16.65,83.9 arc40 16.05,83.85 arc-78 15.45,84 arc88 14.15,84.2 9.06,77.98 arc74 LED17.4-DIN
N$17
  Top 0.2: LED17.2-DOUT 6.8,70.35 arc40 6.4,70.15 arc-87 5.45,70.1 arc108 4.6,69.9 arc8 2.15,62.75 arc40 LED18.4-DIN
N$18  (via drill 0.35)
  Top 0.2: LED18.2-DOUT 6.9,54 arc-36 9.3,51.5 arc64 11.12,50.37 arc-20 v19.4,49.1 | v20.4,48.5 20.4,47.51 LED19.4-DIN
  Bottom 0.254: v20.4,48.5 20.2,48.7 v19.4,49.1
N$19
  Top 0.2: LED20.4-DIN arc60 21.42,61.77 arc22 19.5,54.9 arc1 19.3,52.9 arc-85 18.75,52.4 LED19.2-DOUT
N$20
  Top 0.2: LED21.4-DIN arc48 30.54,73.94 arc16 26.05,69.5 arc-16 25.8,69.25 arc-5 25.05,68.2 arc-81 23.85,67.95 LED20.2-DOUT
N$21
  Top 0.2: LED22.4-DIN 47.56,79.91 45.55,80.55 arc22 38.75,78.75 arc-29 36.8,78.2 arc-61 36.53,78.35 LED21.2-DOUT
N$22
  Top 0.2: LED23.4-DIN arc14 61.9,78.2 61.2,78.75 arc18 54.75,80.55 arc29 53.35,80.75 arc-96 52.5,81.5 LED22.2-DOUT
N$23
  Top 0.2: LED24.4-DIN arc48 74.35,68.9 74.05,69.35 arc21 69.35,74.1 arc-4 68.3,75.05 arc-75 68.1,76.35 LED23.2-DOUT
N$24
  Top 0.2: LED25.4-DIN 80.5,54.45 arc17 79.4,59.5 78.7,61.35 arc23 78.35,62.4 arc-87 78.65,63.65 LED24.2-DOUT
N$25
  Top 0.2: LED26.4-DIN arc-75 77.44,37.68 arc64 78.7,38.65 arc0 79,39.45 arc11 80.4,44.65 80.5,45.25 arc25 80.75,46.9 arc-93 81.3,47.5 LED25.2-DOUT
N$26
  Top 0.2: LED27.4-DIN arc-10 68.12,25.49 arc35 69.35,25.95 70.5,26.85 arc-2 72.6,28.9 arc11 73.35,29.75 arc-5 74.35,31 arc-6 75,32.05 arc-84 75.85,32.25 LED26.2-DOUT
N$27
  Top 0.2: LED28.4-DIN arc15 54.2,19.55 arc26 55.75,19.65 arc-12 57.35,19.95 arc15 58.05,20.1 61.3,21.25 62.65,21.75 arc-99 63.55,21.6 LED27.2-DOUT
N$28
  Top 0.2: LED29.4-DIN arc57 39.45,20.88 arc-6 42.2,20.1 arc16 45.3,19.5 arc15 46.75,19.2 arc-85 47.5,18.4 LED28.2-DOUT
N$29
  Top 0.2: LED30.4-DIN arc80 25.23,31.81 arc6 26.5,29.85 arc18 29.45,26.9 arc-12 30.85,25.65 32.25,24.3 LED29.2-DOUT
N$30
  Top 0.152: 35.6,54.9 arc77 LED31.4-DIN
  Top 0.2: LED30.2-DOUT 22.05,36.77 arc0 21.4,38.3 arc-13 19.6,44.4 19.5,45.4 arc-4 19.45,46.2 arc-3 19.45,48.2 arc-68 19.7,48.55 arc49 19.85,48.7 arc-62 20.35,49.1 arc7 21.9,49.4 33,49.4 arc90 33.25,49.65 33.25,50.65 arc-90 33.55,50.95 arc90 33.85,51.25 arc-18 34.29,54.03 arc-76 35.6,54.9
N$31
  Top 0.2: LED31.2-DOUT 37.2,60.2 arc114 37.9,60.55 arc-52 38.25,61.1 arc23 38.95,61.75 arc-29 40.7,63.2 arc9 41.05,63.4 arc-18 45.45,65.5 arc-61 46.25,65.3 arc49 LED32.4-DIN
N$32
  Top 0.2: LED32.2-DOUT 52.5,66.5 arc91 53.4,65.65 arc-32 55.85,65.05 arc12 56.75,64.65 arc-24 59.9,62.8 arc0 61.15,61.65 arc-39 61.55,60.9 arc-7 LED33.4-DIN
N$33
  Top 0.152: 66.59,50.95 66.6,50.25 66.3,49.6
  Top 0.2: 66.59,50.95 66.35,53.15 arc31 65.5,55.45 arc-94 65.65,56.2 LED33.2-DOUT | LED34.4-DIN arc-37 65.15,45.45 arc54 65.6,45.95 arc-4 65.95,47.1 66.3,49.6
N$34
  Top 0.2: LED34.2-DOUT 62.95,39.6 arc95 62.1,39.3 arc-38 61.15,38.25 arc22 60.5,37.7 arc-17 59.85,37.1 arc-6 57.25,35.55 arc-15 54.1,34.4 arc-75 LED35.4-DIN
N$35
  Top 0.2: LED35.2-DOUT 47.5,33.8 arc89 47.05,34.25 arc-20 44.9,34.65 arc-12 40.65,36.8 arc-18 38.8,38.45 arc-57 LED36.4-DIN
N$36
  Top 0.152: 33.1,48.8 arc11 33.5,49.15 arc43 33.6,49.4 arc0 33.6,50.3 arc-105 34.05,50.65 34.85,50.65 arc-90 34.9,50.6 | 52.35,51.5 arc-90 LED37.4-DIN
  Top 0.2: LED36.2-DOUT 33.4,45.35 arc32 33.35,45.7 arc-29 32.9,48.45 arc-49 33.1,48.8 | 34.9,50.6 48.5,50.6 arc55 49.55,51.15 arc-96 52.35,51.5
N$37
  Top 0.152: 1.73,45.03 L.4-DIN
  Top 0.2: JP3.2 3.4,50 3.4,46.7 arc-90 2.6,45.9 arc90 1.73,45.03
N$38  (via drill 0.3, 0.35)
  Top 0.2: LED37.2-DOUT arc-90 48.65,49.4 65.05,49.4 arc90 v65.65,50 | v67.55,50 80,50 arc-57 80.55,49.7 arc47 81,49.4 90.65,49.4 arc-90 91,49.05 91,48.9 arc90 92.1,47.8 95.1,47.8 arc90 v95.3,48
  Bottom 0.152: v65.65,50 v67.55,50
  Bottom 0.2: v95.3,48 JP1.2
VCC  (via drill 0.35)
  Top 0.2: LED37.1-VDD v49.05,51.65
  Top 0.254: L.1-VDD 3,38.99 v3,38 | v9.8,22.4 9.49,23.02 LED1.1-VDD | v21.9,10.1 21.67,9.88 LED3.1-VDD | LED9.1-VDD v96.8,42.7 | LED13.1-VDD v63,96.65 | v37.2,3.1 36.6,3.37 LED4.1-VDD | v53.75,1.55 53.73,1.21 LED5.1-VDD | LED6.1-VDD v70.35,5.9 | v84.05,15.5 84.13,15.4 LED7.1-VDD | LED8.1-VDD v93.9,29.3 | v97.1,62.4 97.3,61.04 LED10.1-VDD | LED11.1-VDD v90,77.55 | LED12.1-VDD v78.1,89.3 | v45.95,98.6 47.47,98.63 LED14.1-VDD | LED15.1-VDD v29.75,94.25 | LED16.1-VDD v15.95,84.5 | v5.95,70.6 6.46,72.2 LED17.1-VDD | LED30.1-VDD v22.15,35.95 | LED29.1-VDD v32.75,23.5 | LED20.1-VDD v23.4,67.2 | LED21.1-VDD v35.65,78.2 | LED22.1-VDD v51.65,81.6 | LED23.1-VDD v67.35,76.65 | LED24.1-VDD v78.45,64.25 | LED25.1-VDD v81.8,48.2 | LED26.1-VDD v76.6,32.7 | LED27.1-VDD v64.4,21.75 | LED28.1-VDD v48.3,18.25 | LED19.1-VDD 20.2,50.25 32.85,50.05 v32.65,50.05 | LED33.1-VDD v65.3,56.75 | LED32.1-VDD v51.6,66.55 | LED34.1-VDD v63.7,40.1 | LED35.1-VDD v48.45,33.3 | LED36.1-VDD v34.95,43.3 | LED31.1-VDD v36.45,59.6
  Top 0.406: v18.39,51.69 18.02,51.47 17.76,51.47 v16.45,50.7
  Bottom 0.152: v9.8,22.4 C33.2
  Bottom 0.254: v3,36.6 v3,38 3.13,38.13 C10.2 | v10.8,20.6 9.8,21.85 v9.8,22.4 | v23.3,8.9 22.28,9.92 arc-42 v21.9,10.1 20.91,11.09 C24.2 | v96.8,42.7 95.38,42.7 C16.2 | v55.15,1.75 54.22,1.75 v53.75,1.55 C23.2 | v38.95,2.65 38.88,2.72 36.67,3.1 v37.2,3.1 35.13,4.62 C32.2 | v71.9,6.6 v70.35,5.9 67.65,5.9 C22.2 | C12.2 82.01,14.77 v84.05,15.5 84.13,15.43 v85.1,16.4 | v94.6,30.65 v93.9,29.3 93.22,28.62 C13.2 | v96.6,63.7 97.02,62.48 v97.1,62.4 96.68,61.98 C17.2 | v89.15,78.7 v90,77.55 90,74.66 C18.2 | C19.2 78.27,89.13 v78.1,89.3 v77.15,90.2 | C3.2 64.94,94.71 v63,96.65 v61.6,97.2 | v44.4,98.3 44.88,98.3 v45.95,98.6 49.07,97.35 C30.2 | v28.4,93.5 v29.75,94.25 29.78,94.22 C20.2 | v15.95,84.5 15.73,84.3 | 15.73,84.3 17.17,85.6 C4.2 | 15.73,84.3 v14.9,83.55 | C21.2 v2.8,57.15 | C31.2 8.73,72.39 v5.95,70.6 v5.4,69.4 | v21.1,37 v22.15,35.95 22.15,34.68 C27.2 | v31.3,24.05 v32.75,23.5 34.45,23.5 C15.2 | v18.39,51.69 v18.4,53.1 | v16.05,49.3 16.52,50.63 v16.45,50.7 17.97,50.13 C25.2 | v24.1,68.7 v23.4,67.2 C34.2 | v37.1,79.1 v35.65,78.2 35.65,77.09 C6.2 | v53.4,81.6 v51.65,81.6 C5.2 | v68.7,75.95 v67.35,76.65 67.23,76.53 C35.2 | v79.2,62.9 v78.45,64.25 77.46,64.25 C7.2 | v81.85,46.7 v81.8,48.2 81.42,48.58 80.83,48.58 C8.2 82.48,50.34 v82.5,50.35 | v76.6,32.7 76.58,32.66 76.24,32.09 | 76.24,32.09 76.21,32.04 v75.8,31.35 | C9.2 76.24,32.09 | v63.05,20.9 v64.4,21.75 64.4,23.37 C36.2 | v46.7,18.2 v48.3,18.25 49.37,18.25 C26.2 | v32.65,50.05 32.66,50.06 32.95,50.05 v34.25,50.05 | v66.25,55.55 v65.3,56.75 C14.2 | v53.25,66.6 53.2,66.55 v51.6,66.55 C37.2 | v62.9,38.7 v63.7,40.1 63.7,40.96 C1.2 | v46.8,33.3 v48.45,33.3 48.6,33.45 C29.2
  Bottom 0.254: C11.2 35.82,43.3 v34.95,43.3 | v37.2,61.1 v36.45,59.6 C28.2 | v50.45,50.25 48.73,50.25 C2.2
  Bottom 0.406: v50.45,48.55 v50.45,50.25 arc91 v49.05,51.65
  pour Top: -2.72,102 -2,-4 107.14,-1.56 97,102

### Text on the board
tPlace: + | - | DI | DO | - | +
bPlace: + | - | DI | Sat v1 | DO | Paul Klinger | 2018-08-29 | - | +
Reference: PIN 3